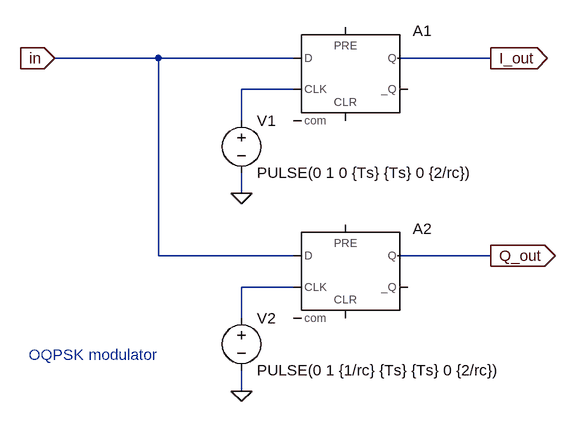
[diagram p0: schematic OQPSK_mod.asc]
OQPSK_mod.asc, the LTspice schematic file:
Version 4
SHEET 1 1148 824
WIRE 160 16 0 16
WIRE 160 320 160 16
WIRE 288 112 288 64
WIRE 288 224 288 192
WIRE 288 416 288 368
WIRE 288 528 288 496
WIRE 368 16 160 16
WIRE 368 64 288 64
WIRE 368 320 160 320
WIRE 368 368 288 368
WIRE 672 16 528 16
WIRE 672 320 528 320
FLAG 288 224 0
FLAG 672 16 I_out
IOPIN 672 16 Out
FLAG 288 528 0
FLAG 672 320 Q_out
IOPIN 672 320 Out
FLAG 0 16 in
IOPIN 0 16 In
SYMBOL voltage 288 96 R0
WINDOW 123 0 0 Left 0
WINDOW 39 0 0 Left 0
SYMATTR InstName V1
SYMATTR Value PULSE(0 1 0 {Ts} {Ts} 0 {2/rc})
SYMBOL Digital\\dflop 448 -32 R0
SYMATTR InstName A1
SYMBOL voltage 288 400 R0
WINDOW 123 0 0 Left 0
WINDOW 39 0 0 Left 0
SYMATTR InstName V2
SYMATTR Value PULSE(0 1 {1/rc} {Ts} {Ts} 0 {2/rc})
SYMBOL Digital\\dflop 448 272 R0
SYMATTR InstName A2
TEXT -40 472 Left 0 ;OQPSK modulator

The netlist it stands for:
* OQPSK_mod.asc
V1 N001 0 PULSE(0 1 0 {Ts} {Ts} 0 {2/rc})
A1 in 0 N001 0 0 0 I_out 0 DFLOP
V2 N002 0 PULSE(0 1 {1/rc} {Ts} {Ts} 0 {2/rc})
A2 in 0 N002 0 0 0 Q_out 0 DFLOP
* OQPSK modulator
.backanno
.end